# EAGLE schematic TPS6273x (EAGLE 7.5.0)
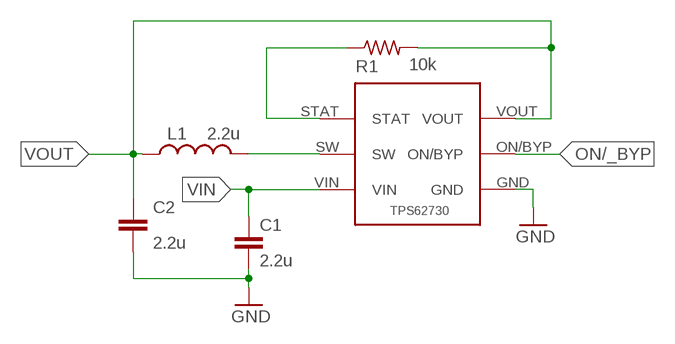
[diagram p0: schematic, sheet 1]

## Parts
C1  2.2u  C-EUC0603  [C0603]
C2  2.2u  C-EUC0603  [C0603]
L1  2.2u  L-USL1210  [L1210]
R1  10k  R-US_R0603  [R0603]
U$1  TPS62730  [TPS62730]

## Nets
GND: C1.2 C2.2 U$1.GND
N$2: L1.2 U$1.SW
N$5: R1.1 U$1.STAT
ON/_BYP: U$1.ON/BYP
VIN: C1.1 U$1.VIN
VOUT: C2.1 L1.1 R1.2 U$1.VOUT

## Library data of the parts
C1 C2 = rcl:C-EU: CAPACITOR, European symbol; SPICEPREFIX: C
L1 = rcl-2:L-US: INDUCTOR, American symbol
R1 = rcl:R-US_: RESISTOR, American symbol; SPICEPREFIX: R
U$1 = TI-TPS6273X:TPS62730: TPS62730: Step Down Converter with Bypass Mode for Ultra Low Power Wireless Applications The TPS62730 is a high frequency synchronous step down DC-DC converter optimized for ultra low power wireless applications. The device is optimized to supply TI&3146;s Low Power Wireless sub 1GHz and 2.4GHz RF transceivers and System-On-Chip-solutions. The TPS62730 reduces the current consumption drawn from the battery during TX and RX mode by a high efficient step down voltage conversion. It provides up to 100mA output current and allows the use of tiny and low cost chip inductors and capacitors. With an input voltage range of 1.9V to 3.9V the device supports Li-primary battery chemistries such as Li-SOCl2, Li-SO2, Li-MnO2 and also two cell alkaline batteries. The TPS62730 features an Ultra Low Power bypass mode with typical 30nA current consumption to support sleep and low power modes of TI’s CC2540 Low Energy and CC430 System-On-Chip solutions. In this bypass mode, the output capacitor of the DC/DC converter is connected via an integrated typ. 2.1Ω Bypass switch to the battery. In DC/DC operation mode the device provides a fixed output voltage to the system. With a switch frequency up to 3MHz, the TPS62730 features low output ripple voltage and low noise even with a small 2.2µF output capacitor. The automatic transition into bypass mode during DC/DC operation prevents an increase of output ripple voltage and noise once the DC/DC converter operates close to 100% duty cycle. The device automatically enters bypass mode once the battery voltage falls below the transition threshold VIT BYP. The TPS62730 is available in a 1 × 1.5mm2 6 pin QFN package.